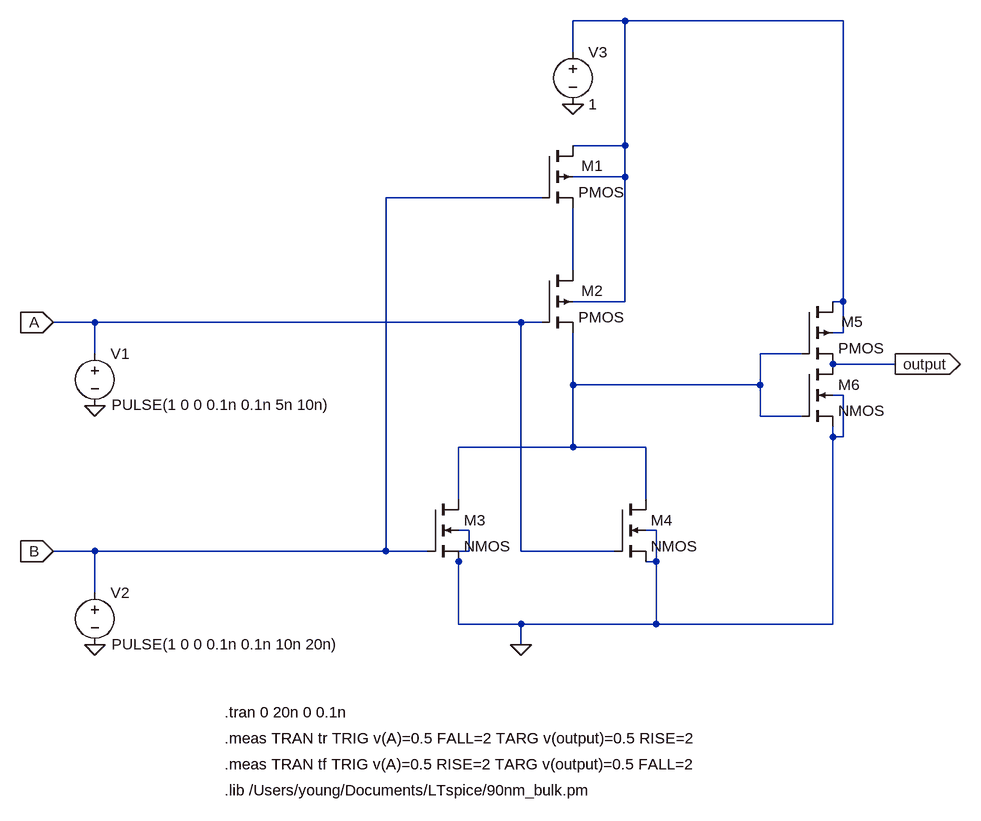
[diagram p0: schematic or.asc]
or.asc, the LTspice schematic file:
Version 4
SHEET 1 1524 1152
WIRE 608 -272 528 -272
WIRE 944 -272 608 -272
WIRE 528 -224 528 -272
WIRE 608 -80 608 -272
WIRE 608 -80 528 -80
WIRE 608 -32 608 -80
WIRE 608 -32 528 -32
WIRE 480 0 240 0
WIRE 528 112 528 16
WIRE 608 160 608 -32
WIRE 608 160 528 160
WIRE 944 160 944 -272
WIRE 944 160 928 160
WIRE -208 192 -272 192
WIRE 448 192 -208 192
WIRE 480 192 448 192
WIRE 944 208 944 160
WIRE 944 208 928 208
WIRE -208 240 -208 192
WIRE 880 240 816 240
WIRE 1024 256 928 256
WIRE 528 288 528 208
WIRE 816 288 816 240
WIRE 816 288 528 288
WIRE 944 304 928 304
WIRE 816 336 816 288
WIRE 880 336 816 336
WIRE 928 368 928 352
WIRE 944 368 944 304
WIRE 944 368 928 368
WIRE 528 384 528 288
WIRE 528 384 352 384
WIRE 640 384 528 384
WIRE 352 464 352 384
WIRE 640 464 640 384
WIRE 368 512 352 512
WIRE 656 512 640 512
WIRE -208 544 -272 544
WIRE 240 544 240 0
WIRE 240 544 -208 544
WIRE 304 544 240 544
WIRE 368 544 368 512
WIRE 368 544 352 544
WIRE 448 544 448 192
WIRE 592 544 448 544
WIRE 352 560 352 544
WIRE 656 560 656 512
WIRE 656 560 640 560
WIRE -208 608 -208 544
WIRE 352 656 352 560
WIRE 448 656 352 656
WIRE 656 656 656 560
WIRE 656 656 448 656
WIRE 928 656 928 368
WIRE 928 656 656 656
WIRE 448 688 448 656
FLAG -272 192 A
IOPIN -272 192 In
FLAG -272 544 B
IOPIN -272 544 In
FLAG 1024 256 output
IOPIN 1024 256 Out
FLAG -208 688 0
FLAG -208 320 0
FLAG 448 688 0
FLAG 528 -144 0
SYMBOL voltage -208 224 R0
WINDOW 3 26 95 Left 2
WINDOW 123 0 0 Left 0
WINDOW 39 0 0 Left 0
SYMATTR Value PULSE(1 0 0 0.1n 0.1n 5n 10n)
SYMATTR InstName V1
SYMBOL voltage -208 592 R0
WINDOW 3 26 95 Left 2
WINDOW 123 0 0 Left 0
WINDOW 39 0 0 Left 0
SYMATTR Value PULSE(1 0 0 0.1n 0.1n 10n 20n)
SYMATTR InstName V2
SYMBOL pmos4 480 -80 R0
WINDOW 0 61 31 Left 2
SYMATTR InstName M1
SYMATTR Value2 l=200N w=400N
SYMBOL pmos4 480 112 R0
WINDOW 0 61 31 Left 2
SYMATTR InstName M2
SYMATTR Value2 l=200N w=400N
SYMBOL nmos4 304 464 R0
SYMATTR InstName M3
SYMATTR Value2 l=200N w=200N
SYMBOL nmos4 592 464 R0
SYMATTR InstName M4
SYMATTR Value2 l=200N w=200N
SYMBOL voltage 528 -240 R0
WINDOW 123 0 0 Left 0
WINDOW 39 0 0 Left 0
SYMATTR InstName V3
SYMATTR Value 1
SYMBOL pmos4 880 160 R0
WINDOW 0 61 31 Left 2
SYMATTR InstName M5
SYMATTR Value2 l=200N w=400N
SYMBOL nmos4 880 256 R0
SYMATTR InstName M6
SYMATTR Value2 l=200N w=200N
TEXT -8 792 Left 2 !.tran 0 20n 0 0.1n
TEXT -8 832 Left 2 !.meas TRAN tr TRIG v(A)=0.5 FALL=2 TARG v(output)=0.5 RISE=2
TEXT -8 872 Left 2 !.meas TRAN tf TRIG v(A)=0.5 RISE=2 TARG v(output)=0.5 FALL=2
TEXT -8 912 Left 2 !.lib /Users/young/Documents/LTspice/90nm_bulk.pm

The netlist it stands for:
* or.asc
V1 A 0 PULSE(1 0 0 0.1n 0.1n 5n 10n)
V2 B 0 PULSE(1 0 0 0.1n 0.1n 10n 20n)
M1 N001 B N002 N001 PMOS l=200N w=400N
M2 N002 A N003 N001 PMOS l=200N w=400N
M3 N003 B 0 0 NMOS l=200N w=200N
M4 N003 A 0 0 NMOS l=200N w=200N
V3 N001 0 1
M5 N001 N003 output N001 PMOS l=200N w=400N
M6 output N003 0 0 NMOS l=200N w=200N
.model NMOS NMOS
.model PMOS PMOS
.lib standard.mos
.tran 0 20n 0 0.1n
.meas TRAN tr TRIG v(A)=0.5 FALL=2 TARG v(output)=0.5 RISE=2
.meas TRAN tf TRIG v(A)=0.5 RISE=2 TARG v(output)=0.5 FALL=2
.lib /Users/young/Documents/LTspice/90nm_bulk.pm
.backanno
.end